# Altium schematic sheet SHR_TM3.SchDoc
size A4; Organization: Organization; Address1: Address1; Address2: Address2; Address3: Address3; Address4: Address4; DocumentNumber: 1; Revision: 0; SheetNumber: 1; SheetTotal: 1; MAS_Product_Code: SHR_TM3; MAS_Order_Number: 20200083; MAS_Project: TESLA_TM3; MAS_Drawn_By: Centeno; MAS_Approved_By: J. Vicandi; MAS_Rev: v0.10; MAS_Client: ORIBAY; MAS_Checked_By: B. Gómez; DocumentFullPathAndName: \\dsmaser\Dpto. Tecnico\Dpto. Transporte\PROYECTOS\ORIBAY\Sensor humedad y Luminosidad_TESLA\2-Hardware\2.1 Esquemas PCB\55SHR_TESLA\SHR_T.SchDoc; DocumentName: SHR_T.SchDoc; ProjectName: SHR_T.PrjPcb
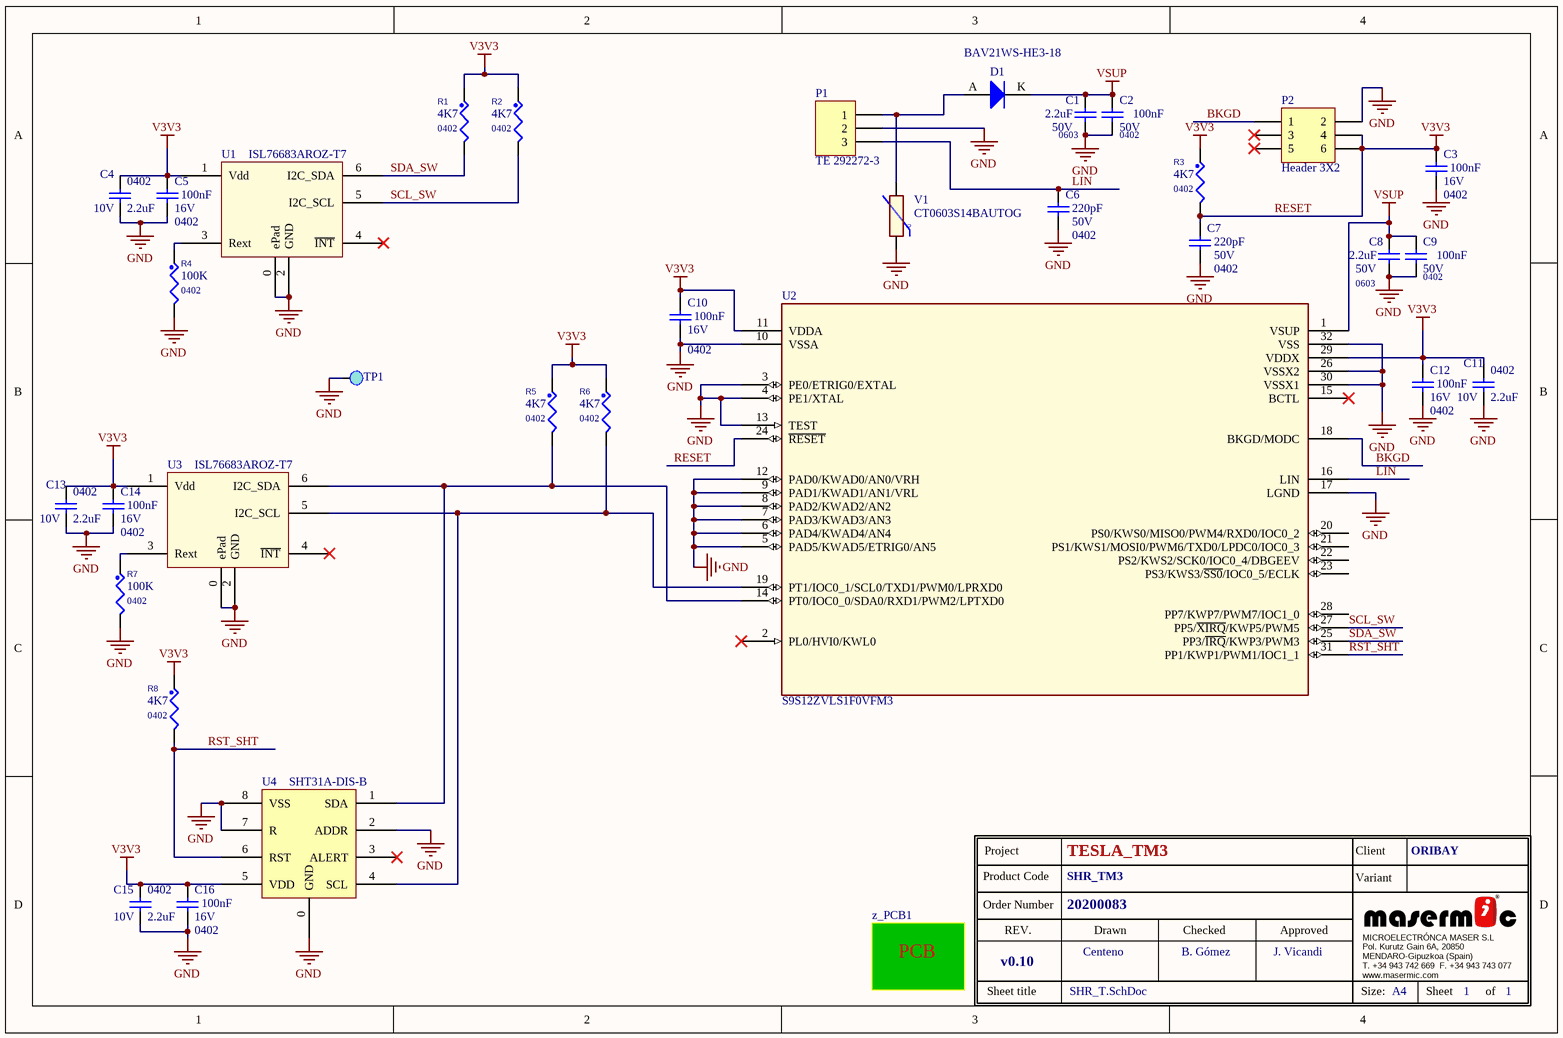
[diagram p0: SHR_TM3.SchDoc]

## Parts
C1  value 2.2uF  Package: 0603  Voltage: 50V  [0603_CAP]  (hidden comment: Capacitor)
C2  value 100nF  Package: 0402  Voltage: 50V  [0603_CAP]  (hidden comment: Capacitor)
C3  value 100nF  Package: 0402  Voltage: 16V  [0402_CAP]  (hidden comment: Capacitor)
C4  value 2.2uF  Package: 0402  Voltage: 10V  [0402_CAP]  (hidden comment: Capacitor)
C5  value 100nF  Package: 0402  Voltage: 16V  [0402_CAP]  (hidden comment: Capacitor)
C6  value 220pF  Package: 0402  Voltage: 50V  [0402_CAP]  (hidden comment: Capacitor)
C7  value 220pF  Package: 0402  Voltage: 50V  [0402_CAP]  (hidden comment: Capacitor)
C8  value 2.2uF  Package: 0603  Voltage: 50V  [0603_CAP]  (hidden comment: Capacitor)
C9  value 100nF  Package: 0402  Voltage: 50V  [0603_CAP]  (hidden comment: Capacitor)
C10  value 100nF  Package: 0402  Voltage: 16V  [0402_CAP]  (hidden comment: Capacitor)
C11  value 2.2uF  Package: 0402  Voltage: 10V  [0402_CAP]  (hidden comment: Capacitor)
C12  value 100nF  Package: 0402  Voltage: 16V  [0402_CAP]  (hidden comment: Capacitor)
C13  value 2.2uF  Package: 0402  Voltage: 10V  [0402_CAP]  (hidden comment: Capacitor)
C14  value 100nF  Package: 0402  Voltage: 16V  [0402_CAP]  (hidden comment: Capacitor)
C15  value 2.2uF  Package: 0402  Voltage: 10V  [0402_CAP]  (hidden comment: Capacitor)
C16  value 100nF  Package: 0402  Voltage: 16V  [0402_CAP]  (hidden comment: Capacitor)
D1  Cod. Fab: BAV21WS-HE3-18  [SOD323 (REFLOW-DIODE_V2) NXP]  (hidden comment: Diode)
P1  TE 292272-3  [CON_TH_3P_1.27mm]
P2  Header 3X2  [HDR2X3]
R1  value 4K7  Package: 0402  [0402_RES]  (hidden comment: Resistor)
R2  value 4K7  Package: 0402  [0402_RES]  (hidden comment: Resistor)
R3  value 4K7  Package: 0402  [0402_RES]  (hidden comment: Resistor)
R4  value 100K  Package: 0402  [0402_RES]  (hidden comment: Resistor)
R5  value 4K7  Package: 0402  [0402_RES]  (hidden comment: Resistor)
R6  value 4K7  Package: 0402  [0402_RES]  (hidden comment: Resistor)
R7  value 100K  Package: 0402  [0402_RES]  (hidden comment: Resistor)
R8  value 4K7  Package: 0402  [0402_RES]  (hidden comment: Resistor)
TP1  TP de Produccion  [TP_0.5]  (value not drawn)  (no BOM)
U1  Cod. Fab: ISL76683AROZ-T7  [ODFN 6 Ld (2.1x2mm)]  (hidden comment: Sensor de luminosidad)
U2  S9S12ZVLS1F0VFM3  [HVQFN-32]
U3  Cod. Fab: ISL76683AROZ-T7  [ODFN 6 Ld (2.1x2mm)]  (hidden comment: Sensor de luminosidad)
U4  Cod. Fab: SHT31A-DIS-B  [DFN8 (SHT31-DIS-B)]  (hidden comment: SHT31-DIS-B)
V1  CT0603S14BAUTOG  [0603_CAP]
z_PCB1  (no value)  (mechanical)

## Nets
GND: C1.1 C2.1 C3.1 C4.1 C5.1 C6.1 C7.1 C8.1 C9.1 C10.1 C11.1 C12.1 C13.1 C14.1 C15.1 C16.1 P1.2 P2.2 R4.2 R7.2 TP1.0 U1.0(ePad) U1.2(GND) U2.3(PE0/ETRIG0/EXTAL) U2.4(PE1/XTAL) U2.5(PAD5/KWAD5/ETRIG0/AN5) U2.6(PAD4/KWAD4/AN4) U2.7(PAD3/KWAD3/AN3) U2.8(PAD2/KWAD2/AN2) U2.9(PAD1/KWAD1/AN1/VRL) U2.10(VSSA) U2.12(PAD0/KWAD0/AN0/VRH) U2.13(TEST) U2.17(LGND) U2.26(VSSX2) U2.30(VSSX1) U2.32(VSS) U3.0(ePad) U3.2(GND) U4.0(GND) U4.2(ADDR) U4.7(R) U4.8(VSS) V1.1
RESET: C3.2 C4.2 C5.2 C7.2 C10.2 C11.2 C12.2 C13.2 C14.2 C15.2 C16.2 P2.4 P2.6 R1.1 R2.1 R3.1 R3.2 R5.1 R6.1 R8.1 U1.1(Vdd) U2.11(VDDA) U2.24(~{RESET}) U2.29(VDDX) U3.1(Vdd) U4.5(VDD)  [also labelled V3V3]
VSUP: C1.2 C2.2 C8.2 C9.2 D1.K U2.1(VSUP)
BKGD: P2.1 U2.18(BKGD/MODC)
LIN: C6.2 P1.3 U2.16(LIN)
RST_SHT: R8.2 U2.31(PP1/KWP1/PWM1/IOC1_1) U4.6(RST)
SCL_SW: R2.2 U1.5(I2C_SCL) U2.27(PP5/~{XIRQ}/KWP5/PWM5)
SDA_SW: R1.2 U1.6(I2C_SDA) U2.25(PP3/~{IRQ}/KWP3/PWM3)
NetD1_A: D1.A P1.1 V1.2
NetR4_1: R4.1 U1.3(Rext)
NetR5_2: R5.2 U2.14(PT0/IOC0_0/SDA0/RXD1/PWM2/LPTXD0) U3.6(I2C_SDA) U4.1(SDA)
NetR6_2: R6.2 U2.19(PT1/IOC0_1/SCL0/TXD1/PWM0/LPRXD0) U3.5(I2C_SCL) U4.4(SCL)
NetR7_1: R7.1 U3.3(Rext)

Not connected (* = marked no-connect by the designer): P2 3* 5*; U1 4(~{INT})*; U2 2(PL0/HVI0/KWL0)* 15(BCTL)* 20(PS0/KWS0/MISO0/PWM4/RXD0/IOC0_2) 21(PS1/KWS1/MOSI0/PWM6/TXD0/LPDC0/IOC0_3) 22(PS2/KWS2/SCK0/IOC0_4/DBGEEV) 23(PS3/KWS3/~{SS0}/IOC0_5/ECLK) 28(PP7/KWP7/PWM7/IOC1_0); U3 4(~{INT})*; U4 3(ALERT)*

## Notes on the sheet
- Project
- Client
- Order Number
- Product Code
- Variant
- REV.
- Drawn
- Checked
- Approved
- MICROELECTRÓNCA MASER S.L
  Pol. Kurutz Gain 6A, 20850 MENDARO-Gipuzkoa (Spain)
  T. +34 943 742 669  F. +34 943 743 077
  www.masermic.com
- Sheet title
- Size:
- A4
- Sheet
- of
- (in symbol CN2220K30AUTOG) U

## Library data of the parts
C1 C8 = Cap Semi: AEC Condensador; Cod. Fab: GRT188R61H225KE13; Fabricante: Murata; Material: X5R; Tolerance: 10%
C2 C9 = Cap Semi: AEC Flexiterm; Cod. Fab: GRT155R71H104KE01; Fabricante: Murata; Material: X7R; Tolerance: 10%
C3 C5 C10 C12 C14 C16 = Cap Semi: AEC Condensador; Cod. Fab: GRT155R71C104KE01; Fabricante: Murata; Material: X7R; Tolerance: 10%
C4 C11 C13 C15 = Cap Semi: AEC Condensador; Cod. Fab: GRT155C71A225KE13; Fabricante: Murata; Material: X7S; Tolerance: 10%
C6 C7 = Cap: AEC Condensador; Material: X7R; Fabricante: Murata; Cod. Fab: GRT155R71H221KE01; Tolerance: 15%
D1 = Diode: AEC Diodo; Fabricante: Vishay; Voltage: 200V; Package: SOD323
P1 = Header 3: AMP Mini CT, PCB Mount Header, Vertical, Wire-to-Board, 3  Position, 1.5mm [.059in] Centerline, 1 Row, Gold, Natural,  Shrouded, Printed Circuit Board
P2 = Header 3X2: Header, 3-Pin, Dual row; LatestRevisionDate: 17-Jul-2002; LatestRevisionNote: Re-released for DXP Platform.; Publisher: Altium Limited
R1-R3 R5 R6 R8 = RES_Dup2: AEC; Power: 1/16w; Cod. Fab: AC0402FR-074K7L; Fabricante: Yageo; Tolerance: 1%; Material: *; Voltage: *
R4 R7 = RES_Dup2: AEC; Power: 1/16W; Cod. Fab: AA0402FR-07100KL; Tolerance: 1%; Voltage: *
U1 U3 = ISL76683: AEC-Q100; Fabricante: Renesas; Voltage: 3V3; Oferta Detalle: *; Oferta Precio: *; Package: 6 Ld ODFN (2.1x2); Value: *; Power: *; Current: *; Datasheet: https://www.renesas.com/eu/en/www/doc/datasheet/isl76683.pdf; Tolerance: *; Temperature: -40 to 105; Supplier Part Number 1: 968-ISL76683AROZ-T7; Supplier 1: Mouser
U2 = S9S12ZVLS1F0VFM3: CLASS: IC
U4 = SHT31-DIS-B: Sensor de humedad; Fabricante: Sensirion; Package: DFN8; Supplier 1: Mouser; Supplier Part Number 1: 403-SHT31ADIS-B10KS
V1 = CN2220K30AUTOG: Fabricante: TDK; Cod. Fab: CT0603S14BAUTOG; Package: 0603
z_PCB1 = PCB: Oferta Precio: 0; Oferta Detalle: *